# EAGLE schematic Smart_Lid (EAGLE 7.6.0)
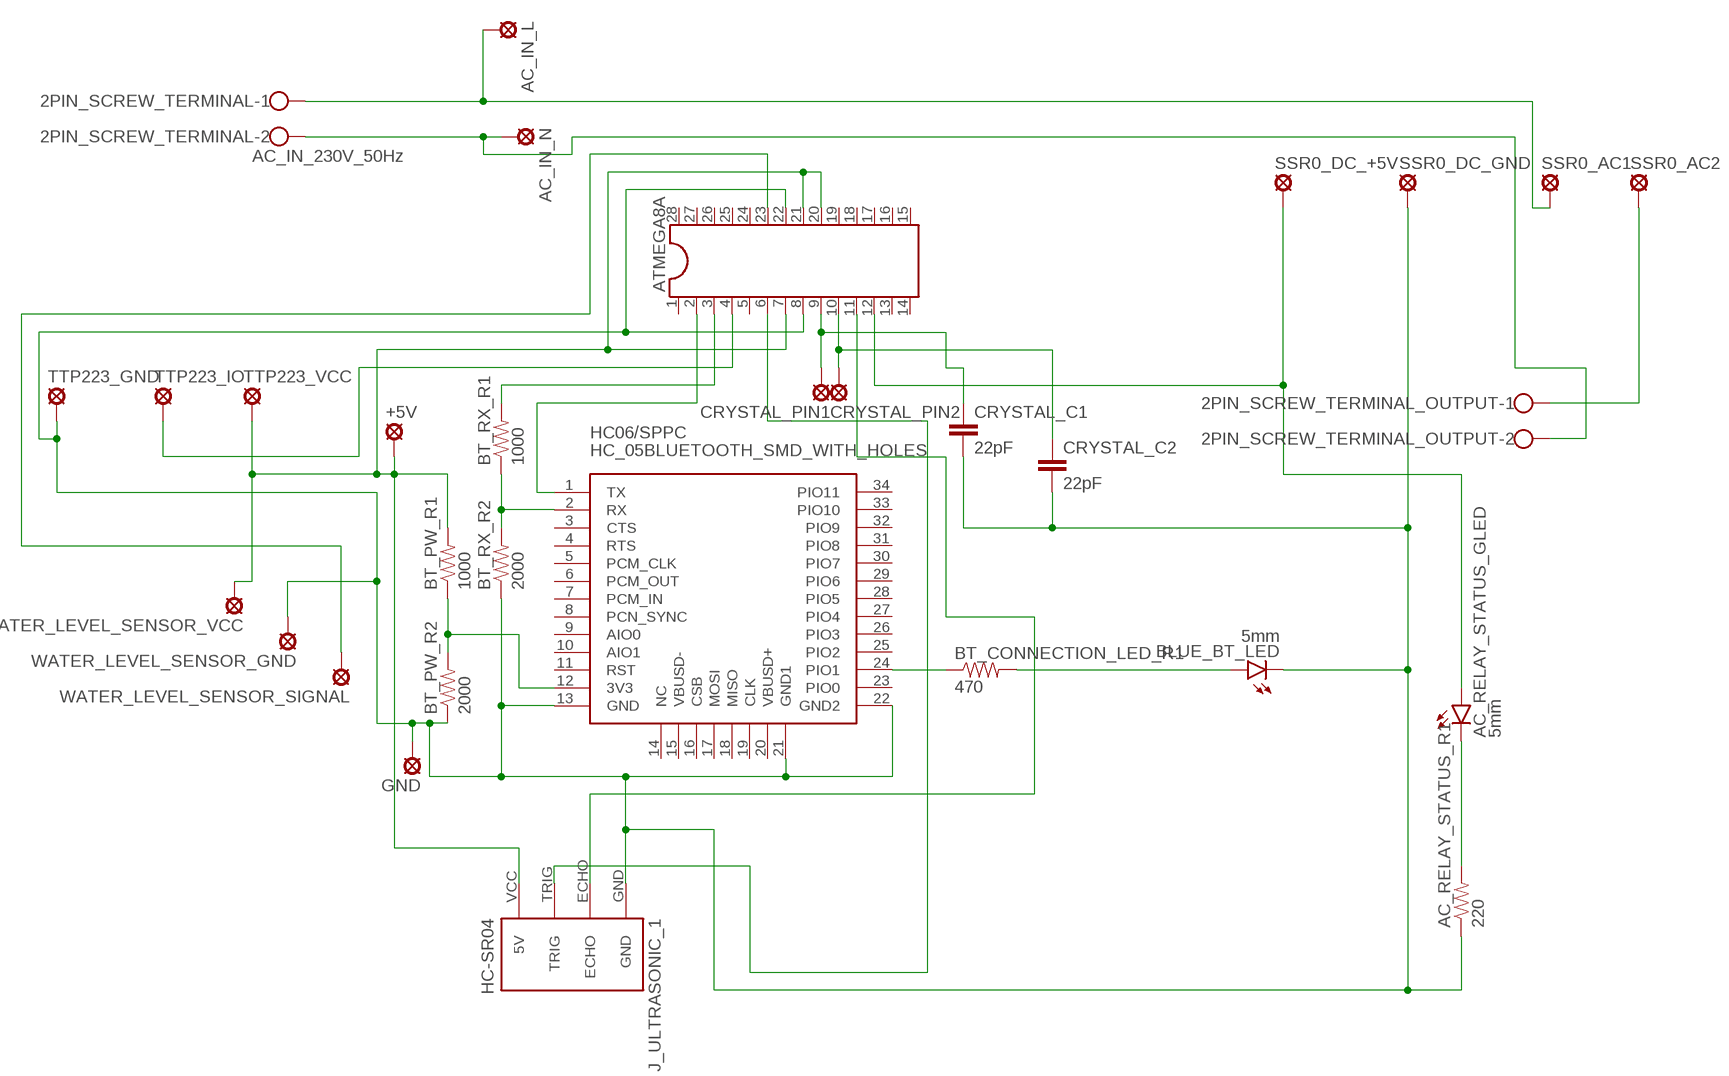
[diagram p0: schematic, sheet 1]

## Parts
2PIN_SCREW_TERMINAL  AC_IN_230V_50Hz  W237-102  [W237-102]
2PIN_SCREW_TERMINAL_OUTPUT  W237-102  [W237-102]
+5V  LSP10  [LSP10]
AC_IN_L  LSP10  [LSP10]
AC_IN_N  LSP10  [LSP10]
AC_RELAY_STATUS_GLED  5mm  LED5MM  [LED5MM]
AC_RELAY_STATUS_R1  220  RESISTOR1206  [1206]
ATMEGA8A  DIL28DIL28-3_MODIFIED  [DIL28-3]
BLUE_BT_LED  5mm  LED5MM  [LED5MM]
BT_CONNECTION_LED_R1  470  RESISTOR1206  [1206]
BT_PW_R1  1000  RESISTOR1206  [1206]
BT_PW_R2  2000  RESISTOR1206  [1206]
BT_RX_R1  1000  RESISTOR1206  [1206]
BT_RX_R2  2000  RESISTOR1206  [1206]
CRYSTAL_C1  22pF  CAP1206  [1206]
CRYSTAL_C2  22pF  CAP1206  [1206]
CRYSTAL_PIN1  LSP10  [LSP10]
CRYSTAL_PIN2  LSP10  [LSP10]
GND  LSP10  [LSP10]
HC06/SPPC  HC_05BLUETOOTH_SMD_WITH_HOLES  [BLUETOOTH_SMD]
J_ULTRASONIC_1  HC-SR04  [HC-SR04_FOOTPRINT]
SSR0_AC1  LSP10  [LSP10]
SSR0_AC2  LSP10  [LSP10]
SSR0_DC_+5V  LSP10  [LSP10]
SSR0_DC_GND  LSP10  [LSP10]
TTP223_GND  LSP10  [LSP10]
TTP223_IO  LSP10  [LSP10]
TTP223_VCC  LSP10  [LSP10]
WATER_LEVEL_SENSOR_GND  LSP10  [LSP10]
WATER_LEVEL_SENSOR_SIGNAL  LSP10  [LSP10]
WATER_LEVEL_SENSOR_VCC  LSP10  [LSP10]

## Nets
N$1: ATMEGA8A.2 HC06/SPPC.1(TX)
N$2: 2PIN_SCREW_TERMINAL.1 AC_IN_L.MP SSR0_AC1.MP
N$3: 2PIN_SCREW_TERMINAL_OUTPUT.1 SSR0_AC2.MP
N$4: BT_CONNECTION_LED_R1.1 HC06/SPPC.24(PIO1)
N$5: BLUE_BT_LED.A BT_CONNECTION_LED_R1.2
N$6: BT_RX_R1.1 BT_RX_R2.2 HC06/SPPC.2(RX)
N$7: AC_RELAY_STATUS_R1.1 ATMEGA8A.8 ATMEGA8A.22 BLUE_BT_LED.K(C) BT_PW_R2.1 BT_RX_R2.1 CRYSTAL_C1.2 CRYSTAL_C2.2 GND.MP HC06/SPPC.13(GND) HC06/SPPC.21(GND1) HC06/SPPC.22(GND2) J_ULTRASONIC_1.GND SSR0_DC_GND.MP TTP223_GND.MP WATER_LEVEL_SENSOR_GND.MP
N$8: ATMEGA8A.23 WATER_LEVEL_SENSOR_SIGNAL.MP
N$9: ATMEGA8A.3 BT_RX_R1.2
N$10: 2PIN_SCREW_TERMINAL.2 2PIN_SCREW_TERMINAL_OUTPUT.2 AC_IN_N.MP
N$11: ATMEGA8A.4 TTP223_IO.MP
N$12: +5V.MP ATMEGA8A.7 ATMEGA8A.20 ATMEGA8A.21 BT_PW_R1.2 J_ULTRASONIC_1.VCC(5V) TTP223_VCC.MP WATER_LEVEL_SENSOR_VCC.MP
N$13: ATMEGA8A.6 J_ULTRASONIC_1.TRIG
N$14: ATMEGA8A.9 CRYSTAL_C1.1 CRYSTAL_PIN1.MP
N$15: ATMEGA8A.10 CRYSTAL_C2.1 CRYSTAL_PIN2.MP
N$16: AC_RELAY_STATUS_GLED.K(C) AC_RELAY_STATUS_R1.2
N$18: AC_RELAY_STATUS_GLED.A ATMEGA8A.12 SSR0_DC_+5V.MP
N$19: ATMEGA8A.11 J_ULTRASONIC_1.ECHO
N$20: BT_PW_R1.1 BT_PW_R2.2 HC06/SPPC.12(3V3)
Unconnected: ATMEGA8A.1 ATMEGA8A.5 ATMEGA8A.13 ATMEGA8A.14 ATMEGA8A.15 ATMEGA8A.16 ATMEGA8A.17 ATMEGA8A.18 ATMEGA8A.19 ATMEGA8A.24 ATMEGA8A.25 ATMEGA8A.26 ATMEGA8A.27 ATMEGA8A.28 HC06/SPPC.3(CTS) HC06/SPPC.4(RTS) HC06/SPPC.5(PCM_CLK) HC06/SPPC.6(PCM_OUT) HC06/SPPC.7(PCM_IN) HC06/SPPC.8(PCN_SYNC) HC06/SPPC.9(AIO0) HC06/SPPC.10(AIO1) HC06/SPPC.11(RST) HC06/SPPC.14(NC) HC06/SPPC.15(VBUSD-) HC06/SPPC.16(CSB) HC06/SPPC.17(MOSI) HC06/SPPC.18(MISO) HC06/SPPC.19(CLK) HC06/SPPC.20(VBUSD+) HC06/SPPC.23(PIO0) HC06/SPPC.25(PIO2) HC06/SPPC.26(PIO3) HC06/SPPC.27(PIO4) HC06/SPPC.28(PIO5) HC06/SPPC.29(PIO6) HC06/SPPC.30(PIO7) HC06/SPPC.31(PIO8) HC06/SPPC.32(PIO9) HC06/SPPC.33(PIO10) HC06/SPPC.34(PIO11)

## Library data of the parts
2PIN_SCREW_TERMINAL 2PIN_SCREW_TERMINAL_OUTPUT = con-wago-500:W237-102: WAGO SCREW CLAMP; MPN: 237-102; OC_FARNELL: unknown; OC_NEWARK: 70K9898
+5V AC_IN_L AC_IN_N CRYSTAL_PIN1 CRYSTAL_PIN2 GND SSR0_AC1 SSR0_AC2 SSR0_DC_+5V SSR0_DC_GND TTP223_GND TTP223_IO TTP223_VCC WATER_LEVEL_SENSOR_GND WATER_LEVEL_SENSOR_SIGNAL WATER_LEVEL_SENSOR_VCC = solpad:LSP10: SOLDER PAD drill 1.0 mm, distributor Buerklin, 12H555
AC_RELAY_STATUS_GLED BLUE_BT_LED = SparkFun-LED:LED: LEDs Standard schematic elements and footprints for 5mm, 3mm, 1206, and 0603 sized LEDs. 5mm - Spark Fun Electronics SKU : COM-00529 (and others)
AC_RELAY_STATUS_R1 BT_CONNECTION_LED_R1 BT_PW_R1 BT_PW_R2 BT_RX_R1 BT_RX_R2 = SparkFun-Resistors:RESISTOR: Resistor Basic schematic elements and footprints for 0603, 1206, and PTH resistors.
ATMEGA8A = ic-package_modified:DIL28: Dual In Line
CRYSTAL_C1 CRYSTAL_C2 = SparkFun-Capacitors:CAP: Capacitor Standard 0603 ceramic capacitor, and 0.1" leaded capacitor.
HC06/SPPC = Bluetooth HC-05_modified:HC_05: HC-05 Bluetooth Module
J_ULTRASONIC_1 = Ultrasonic Sensor HC-SR04:HC-SR04: Ultrasonic Sensor HC-SR04